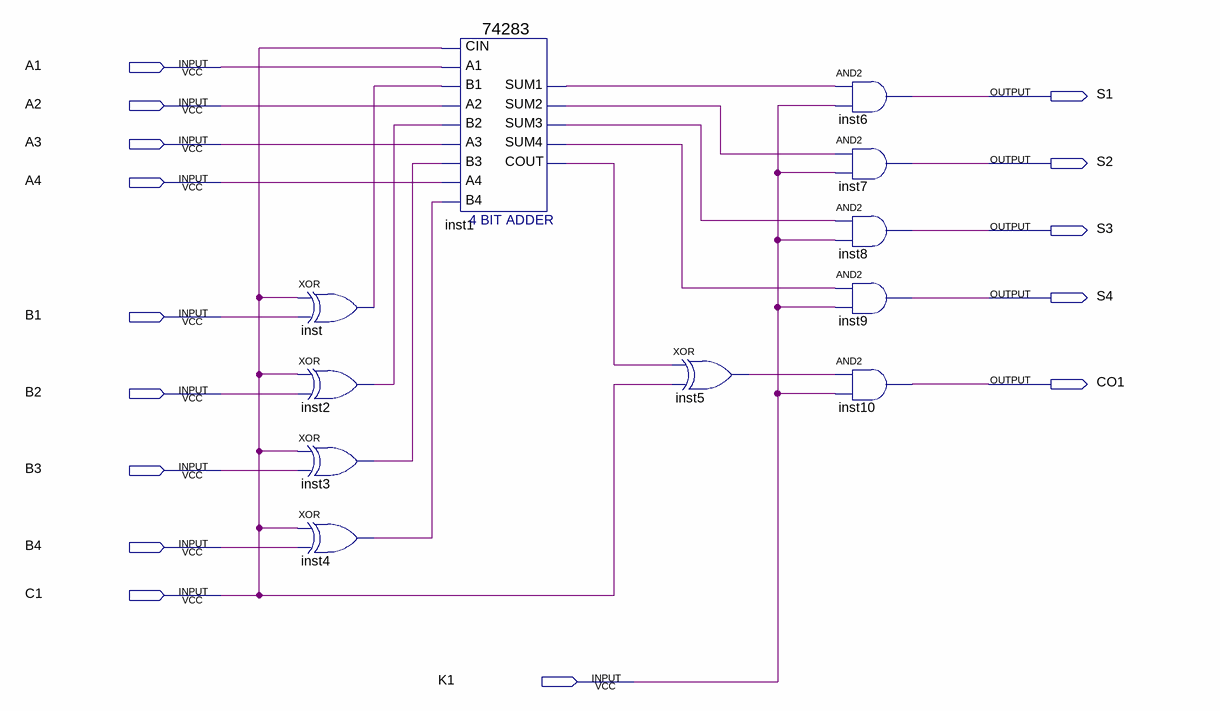
[diagram p0: schematic sheet]
// Quartus schematic Block1.bdf as structural Verilog: 11 symbols, 15 pins
module Block1 (
  input  A1,
  input  A2,
  input  A3,
  input  A4,
  input  B1,
  input  B2,
  input  B3,
  input  B4,
  input  C1,
  input  K1,
  output S1,
  output S2,
  output S3,
  output S4,
  output CO1
);

  wire inst1_cout, inst1_sum1, inst1_sum2, inst1_sum3, inst1_sum4, inst2_out, inst3_out, inst4_out,
       inst5_out, inst_out;

  xor inst (inst_out, C1, B1);
  xor inst2 (inst2_out, C1, B2);
  xor inst3 (inst3_out, C1, B3);
  xor inst4 (inst4_out, C1, B4);
  \74283  inst1 (
    .CIN(C1), .A1(A1), .A2(A2), .B2(inst2_out), .A3(A3), .A4(A4), .B4(inst4_out), .B1(inst_out),
    .B3(inst3_out), .SUM4(inst1_sum4), .COUT(inst1_cout), .SUM1(inst1_sum1), .SUM2(inst1_sum2),
    .SUM3(inst1_sum3));
  xor inst5 (inst5_out, inst1_cout, C1);
  and inst6 (S1, inst1_sum1, K1);
  and inst7 (S2, inst1_sum2, K1);
  and inst8 (S3, inst1_sum3, K1);
  and inst9 (S4, inst1_sum4, K1);
  and inst10 (CO1, inst5_out, K1);
endmodule
